# Altium project Switching_Circuit.PrjPcb
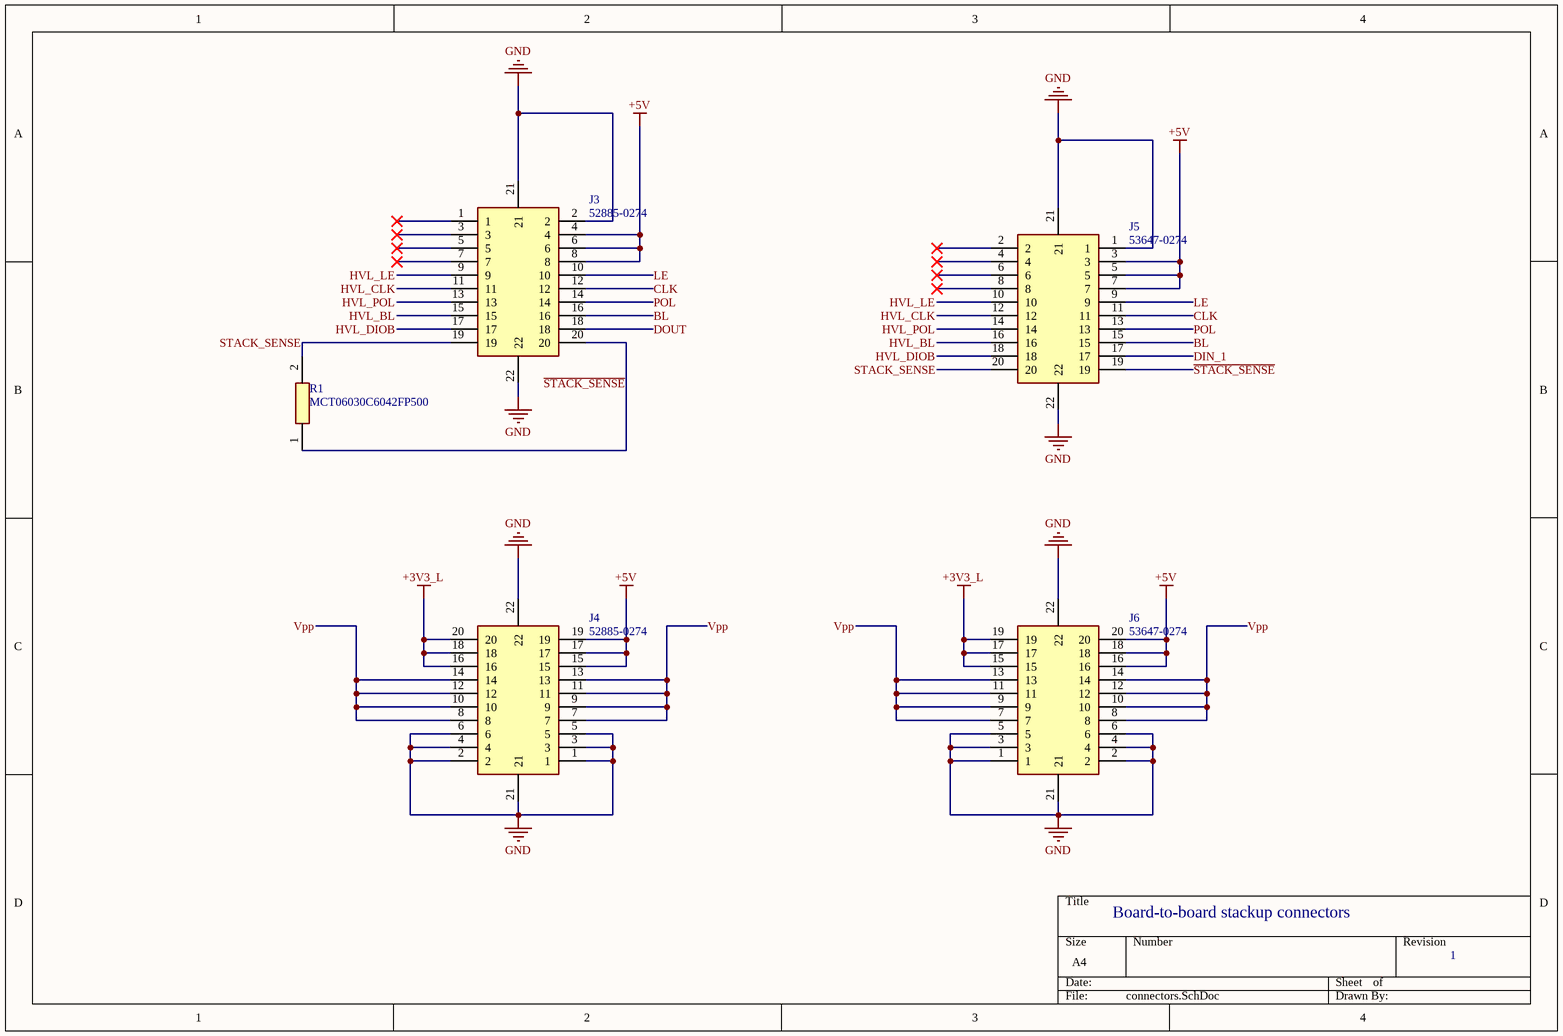
[diagram p0: connectors.SchDoc]
1 sheet, 5 parts. Net scope: global (net labels, ports and power ports of the same name join across sheets).
Board file: switch_board.PcbDoc

## Sheet connectors.SchDoc
size A4; SheetNumber: 2; SheetTotal: 2

### Parts
J3  52885-0274  [528850274]
J4  52885-0274  [528850274]
J5  53647-0274  [536470274]
J6  53647-0274  [536470274]
R1  MCT06030C6042FP500  [RESC1608X55N]

### Nets
+3V3_L: J4.16 J4.18 J4.20 J6.15 J6.17 J6.19
+5V: J3.4 J3.6 J3.8 J4.15 J4.17 J4.19 J5.3 J5.5 J5.7 J6.16 J6.18 J6.20
GND: J3.2 J3.21 J3.22 J4.1 J4.2 J4.3 J4.4 J4.5 J4.6 J4.21 J4.22 J5.1 J5.21 J5.22 J6.1 J6.2 J6.3 J6.4 J6.5 J6.6 J6.21 J6.22
~{STACK_SENSE}: J3.20 J5.19 R1.1
BL: J3.16 J5.15
CLK: J3.12 J5.11
DIN_1: J5.17
DOUT: J3.18
HVL_BL: J3.15 J5.16
HVL_CLK: J3.11 J5.12
HVL_DIOB: J3.17 J5.18
HVL_LE: J3.9 J5.10
HVL_POL: J3.13 J5.14
LE: J3.10 J5.9
POL: J3.14 J5.13
STACK_SENSE: J3.19 J5.20 R1.2
Vpp: J4.7 J4.8 J4.9 J4.10 J4.11 J4.12 J4.13 J4.14 J6.7 J6.8 J6.9 J6.10 J6.11 J6.12 J6.13 J6.14

Not connected (* = marked no-connect by the designer): J3 1* 3* 5* 7*; J5 2* 4* 6* 8*

### Notes on the sheet
- Board-to-board stackup connectors
- 1

### Library data of the parts
J3 J4 = 52885-0274: Connector; Manufacturer_Name: Molex; Datasheet Link: https://www.molex.com/webdocs/datasheets/pdf/en-us/0528850274_PCB_RECEPTACLES.pdf; Height: 4mm; Manufacturer_Part_Number: 52885-0274; Mouser Part Number: 538-52885-0274; Mouser Price/Stock: https://www.mouser.co.uk/ProductDetail/Molex/52885-0274?qs=%252BPJ3Ll1xQNYiQig4hWY5jQ%3D%3D
J5 J6 = 53647-0274: Connector; Manufacturer_Name: Molex; Datasheet Link: https://www.molex.com/pdm_docs/sd/536470274_sd.pdf; Height: 7mm; Manufacturer_Part_Number: 53647-0274; Mouser Part Number: 538-53647-0274; Mouser Price/Stock: https://www.mouser.co.uk/ProductDetail/Molex/53647-0274?qs=8nk6kXN3TSGT9To7JpUGHA%3D%3D
R1 = MCT06030C6042FP500: Resistor; Manufacturer_Name: Vishay; Datasheet Link: http://www.vishay.com/docs/28705/mcx0x0xpro.pdf; Height: 0.55mm; Manufacturer_Part_Number: MCT06030C6042FP500